# EAGLE schematic main (EAGLE 6.5.0)
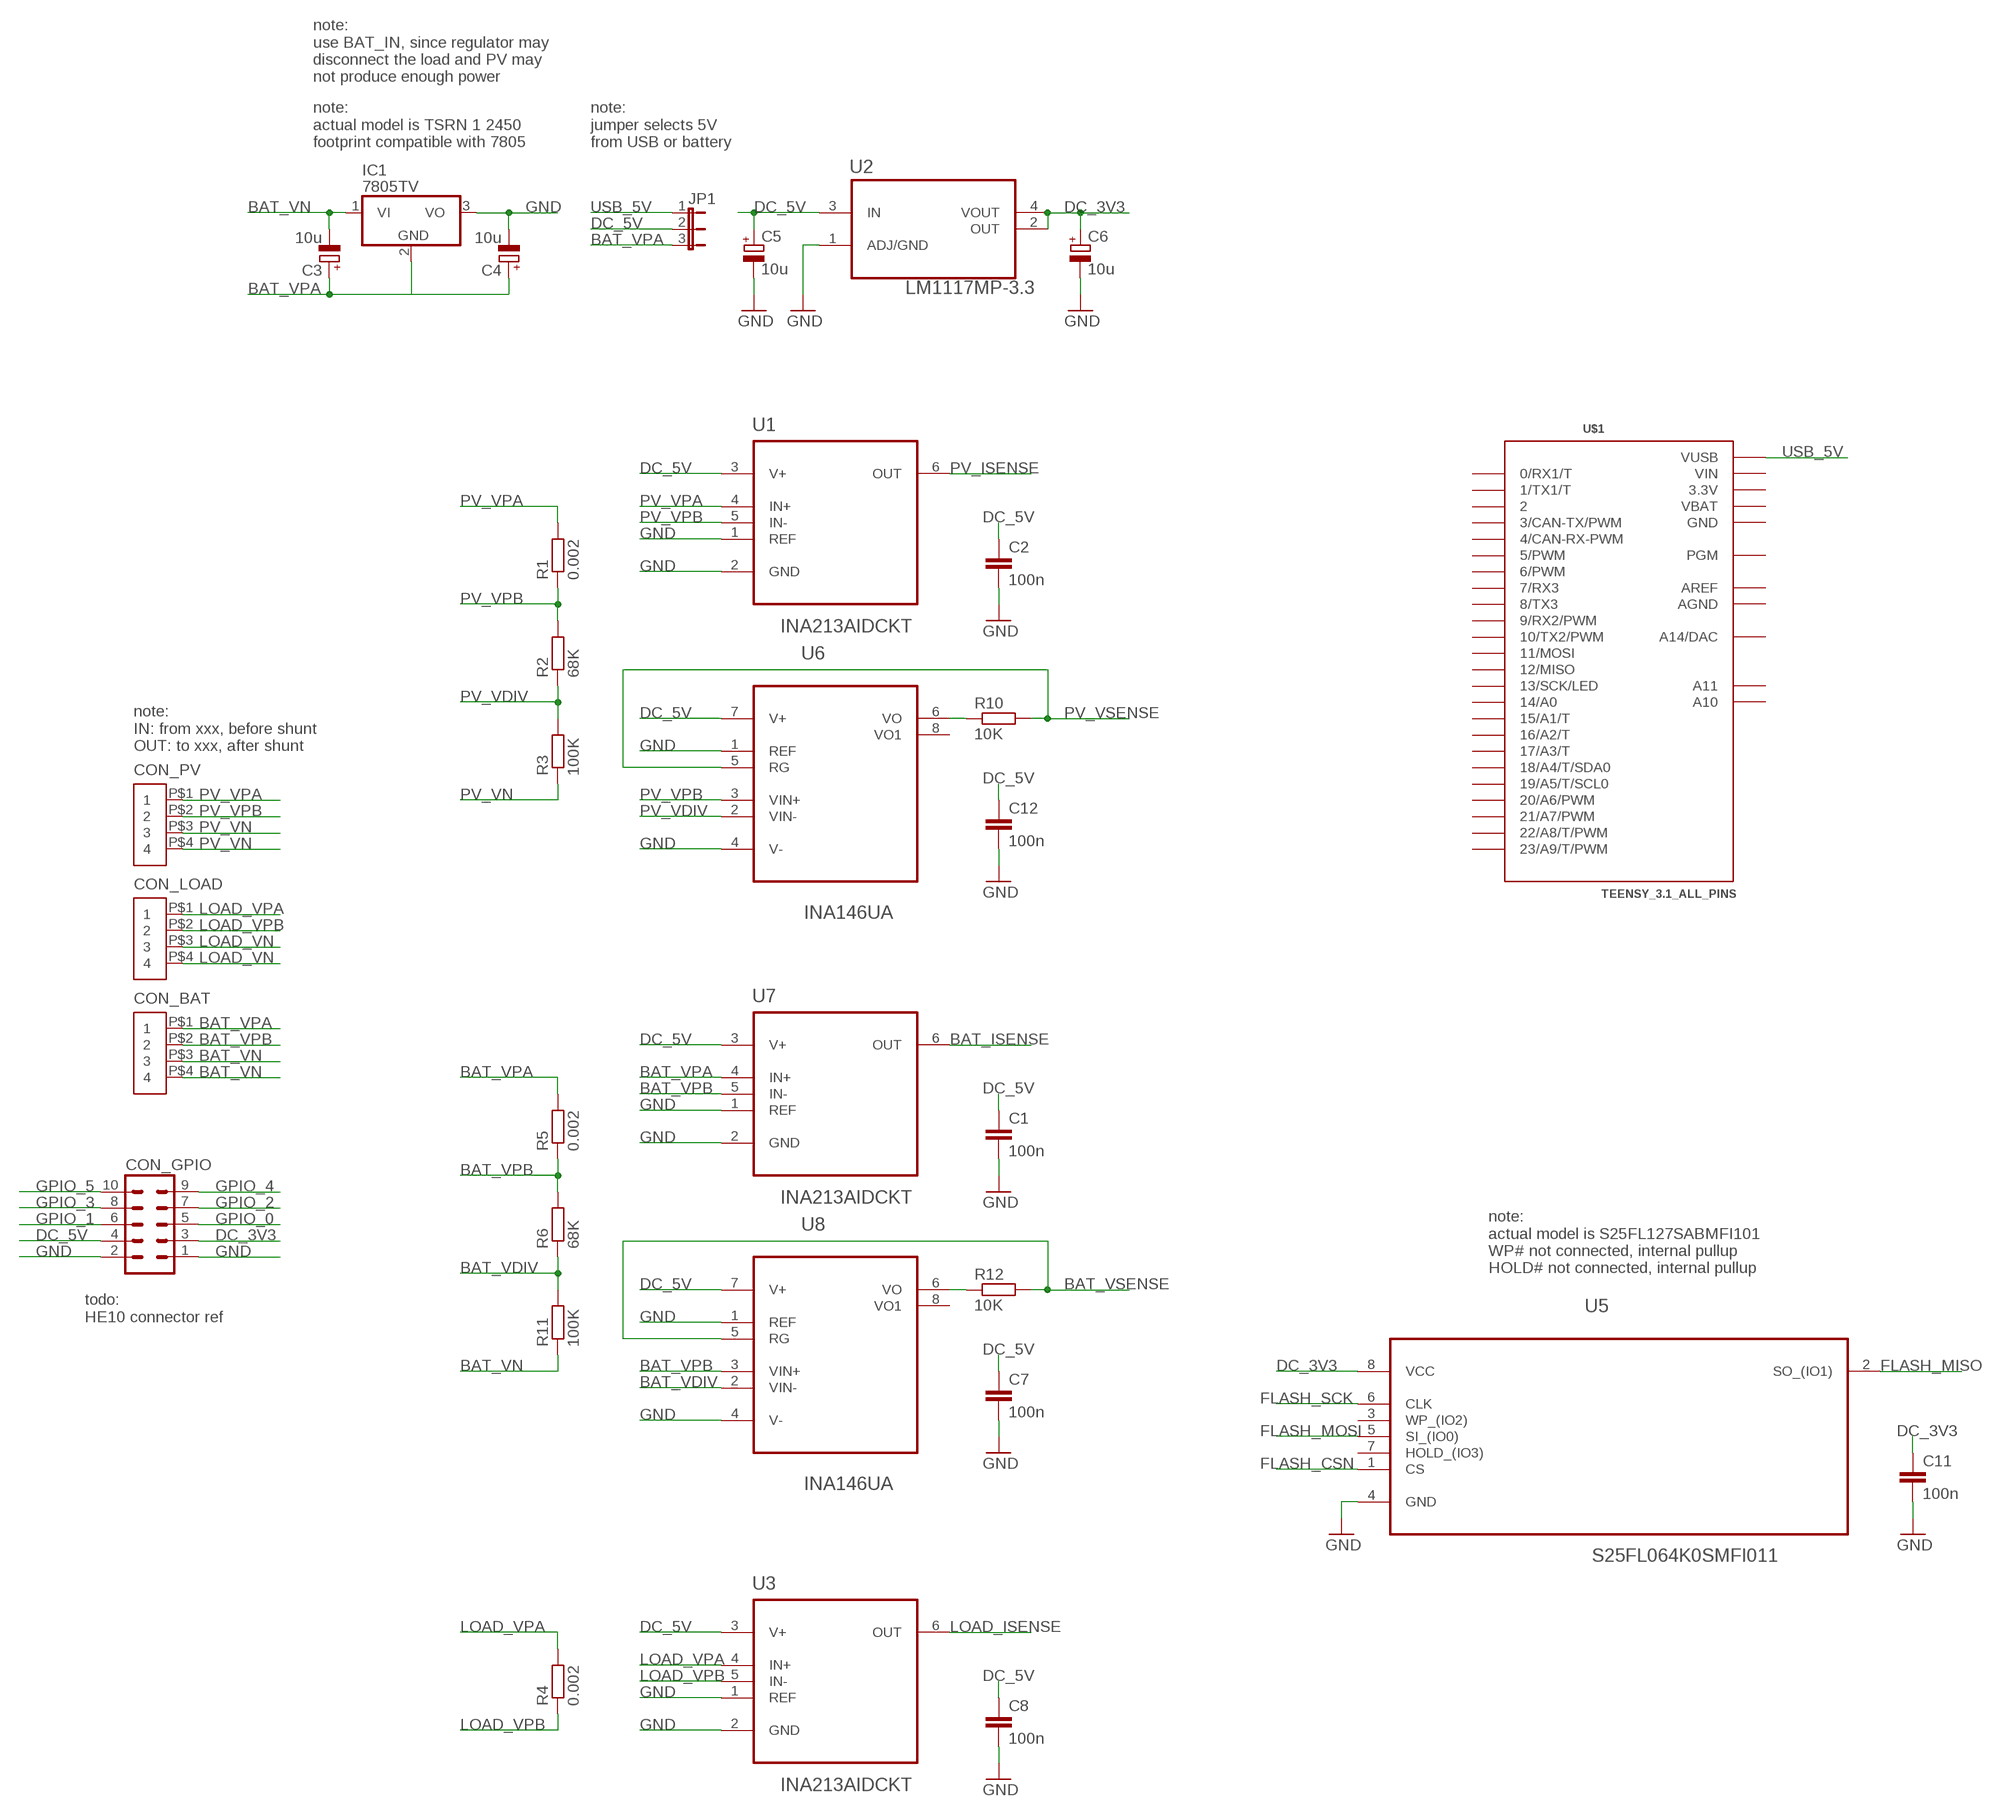
[diagram p0: schematic, sheet 1]

## Parts
C1  100n  C-EUC1206  [C1206]
C2  100n  C-EUC1206  [C1206]
C3  10u  CPOL-EUCT3528  [CT3528]
C4  10u  CPOL-EUCT3528  [CT3528]
C5  10u  CPOL-EUCT3528  [CT3528]
C6  10u  CPOL-EUCT3528  [CT3528]
C7  100n  C-EUC1206  [C1206]
C8  100n  C-EUC1206  [C1206]
C11  100n  C-EUC1206  [C1206]
C12  100n  C-EUC1206  [C1206]
CON_BAT  MC000036  [MC000036]
CON_GPIO  MA05-2  [MA05-2]
CON_LOAD  MC000036  [MC000036]
CON_PV  MC000036  [MC000036]
IC1  7805TV  [TO220V]
JP1  JP2E  [JP2]
R1  0.002  R-EU_R2512  [R2512]
R2  68K  R-EU_R0603  [R0603]
R3  100K  R-EU_R0603  [R0603]
R4  0.002  R-EU_R2512  [R2512]
R5  0.002  R-EU_R2512  [R2512]
R6  68K  R-EU_R0603  [R0603]
R10  10K  R-EU_R0603  [R0603]
R11  100K  R-EU_R0603  [R0603]
R12  10K  R-EU_R0603  [R0603]
U1  INA213AIDCKT  [SOT65P210X110-6N]
U2  LM1117MP-3.3  [SOT230P696X180-4N]
U3  INA213AIDCKT  [SOT65P210X110-6N]
U5  S25FL064K0SMFI011  [SOIC127P800X215-8N]
U6  INA146UA  [SOIC127P600X175-8N]
U7  INA213AIDCKT  [SOT65P210X110-6N]
U8  INA146UA  [SOIC127P600X175-8N]
U$1  TEENSY_3.1_ALL_PINS  [TEENSY3-ALL_PINS]

## Nets
BAT_ISENSE: U7.6(OUT)
BAT_VDIV: R6.1 R11.2 U8.2(VIN-)
BAT_VN: C3.- CON_BAT.P$3 CON_BAT.P$4 IC1.1(VI) R11.1
BAT_VPA: C3.+ C4.+ CON_BAT.P$1 JP1.3 R5.2 U7.4(IN+)
BAT_VPB: CON_BAT.P$2 R5.1 R6.2 U7.5(IN-) U8.3(VIN+)
BAT_VSENSE: R12.2 U8.5(RG)
DC_3V3: C6.+ C11.1 CON_GPIO.3 U2.2(OUT) U2.4(VOUT) U5.8(VCC)
DC_5V: C1.1 C2.1 C5.+ C7.1 C8.1 C12.1 CON_GPIO.4 JP1.2 U1.3(V+) U2.3(IN) U3.3(V+) U6.7(V+) U7.3(V+) U8.7(V+)
FLASH_CSN: U5.1(CS)
FLASH_MISO: U5.2(SO_(IO1))
FLASH_MOSI: U5.5(SI_(IO0))
FLASH_SCK: U5.6(CLK)
GND: C1.2 C2.2 C4.- C5.- C6.- C7.2 C8.2 C11.2 C12.2 CON_GPIO.1 CON_GPIO.2 IC1.3(VO) U1.1(REF) U1.2(GND) U2.1(ADJ/GND) U3.1(REF) U3.2(GND) U5.4(GND) U6.1(REF) U6.4(V-) U7.1(REF) U7.2(GND) U8.1(REF) U8.4(V-)
GPIO_0: CON_GPIO.5
GPIO_1: CON_GPIO.6
GPIO_2: CON_GPIO.7
GPIO_3: CON_GPIO.8
GPIO_4: CON_GPIO.9
GPIO_5: CON_GPIO.10
LOAD_ISENSE: U3.6(OUT)
LOAD_VN: CON_LOAD.P$3 CON_LOAD.P$4
LOAD_VPA: CON_LOAD.P$1 R4.2 U3.4(IN+)
LOAD_VPB: CON_LOAD.P$2 R4.1 U3.5(IN-)
N$1: R12.1 U8.6(VO)
N$2: R10.1 U6.6(VO)
N$4: IC1.2(GND)
PV_ISENSE: U1.6(OUT)
PV_VDIV: R2.1 R3.2 U6.2(VIN-)
PV_VN: CON_PV.P$3 CON_PV.P$4 R3.1
PV_VPA: CON_PV.P$1 R1.2 U1.4(IN+)
PV_VPB: CON_PV.P$2 R1.1 R2.2 U1.5(IN-) U6.3(VIN+)
PV_VSENSE: R10.2 U6.5(RG)
USB_5V: JP1.1 U$1.VUSB
Unconnected: U5.3(WP_(IO2)) U5.7(HOLD_(IO3)) U6.8(VO1) U8.8(VO1) U$1.0(0/RX1/T) U$1.1(1/TX1/T) U$1.2 U$1.3(3/CAN-TX/PWM) U$1.4(4/CAN-RX-PWM) U$1.5(5/PWM) U$1.6(6/PWM) U$1.7(7/RX3) U$1.8(8/TX3) U$1.9(9/RX2/PWM) U$1.10(10/TX2/PWM) U$1.11(11/MOSI) U$1.12(12/MISO) U$1.13(13/SCK/LED) U$1.14/A0 U$1.15/A1(15/A1/T) U$1.16/A2(16/A2/T) U$1.17/A3(17/A3/T) U$1.18/A4(18/A4/T/SDA0) U$1.19/A5(19/A5/T/SCL0) U$1.20/A6(20/A6/PWM) U$1.21/A7(21/A7/PWM) U$1.22/A8(22/A8/T/PWM) U$1.23/A9(23/A9/T/PWM) U$1.A10 U$1.A11 U$1.PGM U$1.RESET/DAC(A14/DAC)

## Notes on the sheet
- note:
  use BAT_IN, since regulator may
  disconnect the load and PV may
  not produce enough power
- note:
  actual model is TSRN 1 2450
  footprint compatible with 7805
- note:
  jumper selects 5V
  from USB or battery
- note:
  IN: from xxx, before shunt
  OUT: to xxx, after shunt
- note:
  actual model is S25FL127SABMFI101
  WP# not connected, internal pullup
  HOLD# not connected, internal pullup
- todo:
  HE10 connector ref

## Power pins joined to a net without a drawn wire
3.3V: U$1.3.3V U$1.3.3V1(3.3V)
AGND: U$1.AGND
AREF: U$1.AREF
GND: U$1.GND U$1.GND1(GND)
VBAT: U$1.VBAT
VIN: U$1.VIN

## Library data of the parts
C1 C2 C7 C8 C11 C12 = rcl:C-EU: CAPACITOR, European symbol
C3-C6 = rcl:CPOL-EU: POLARIZED CAPACITOR, European symbol
CON_BAT CON_LOAD CON_PV = MC000036:MC000036
CON_GPIO = con-lstb:MA05-2: PIN HEADER; OC_FARNELL: unknown; OC_NEWARK: unknown
IC1 = linear:78*: Positive VOLTAGE REGULATOR Source: http://cache.national.com/ds/LM/LM78L05.pdf http://www.fairchildsemi.com/ds/LM/LM7805.pdf
JP1 = jumper:JP2E: JUMPER
R1 R4 R5 = resistor:R-EU_: RESISTOR, European symbol
R2 R3 R6 R10-R12 = rcl:R-EU_: RESISTOR, European symbol
U1 U3 U7 = TI-INA213AIDCKT:INA213AIDCKT: CURRENT SHUNT MONITOR; MPN: INA213AIDCKT; OC_FARNELL: 1754261; OC_NEWARK: 05N1040; PACKAGE: SC-70-6; SUPPLIER: Texas Instruments
U2 = NSC-LM1117MP-3.3:LM1117MP-3.3: Linear regulators; MPN: LM1117MP-3.3; OC_FARNELL: 9778195; OC_NEWARK: 41K3470; PACKAGE: SOT223-3; SUPPLIER: NationalSemiconductor
U5 = Spansion_By_element14_Batch_1:S25FL064K0SMFI011: 64-Mbit CMOS 3.0 Volt Flash Memory; MPN: S25FL064K0SMFI011; OC_FARNELL: 1861631; OC_NEWARK: 27T2974; PACKAGE: SOIC-8; SUPPLIER: SPANSION
U6 U8 = Texas Instruments_By_element14_Batch_1:INA146UA: DIFFERENCE AMPLIFIER; MPN: INA146UA; OC_FARNELL: 1097463; OC_NEWARK: 74K3815; PACKAGE: SOIC-8; SUPPLIER: TI
U$1 = Teensy_3_and_LC_Series_Boards_v1.1:TEENSY_3.1_ALL_PINS: Footprint for Teensy 3.1 or 3.2 board using all through-holes, i.e. the entire perimeter plus the 4 through-holes inboard (A10,A11,AREF, VUSB)